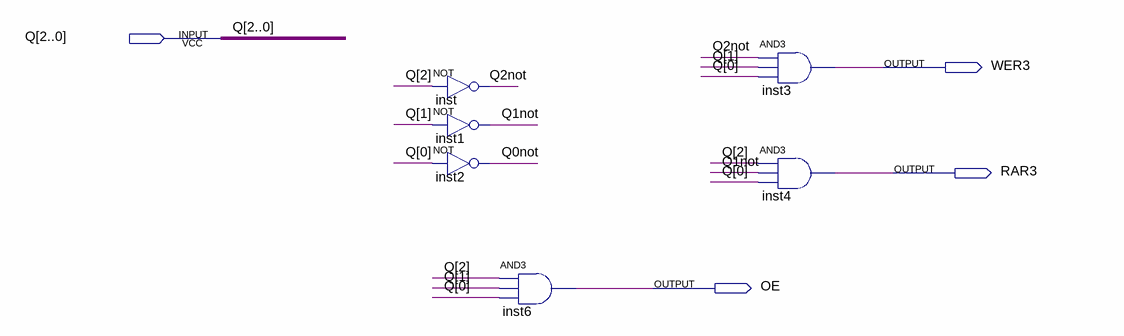
[diagram p0: schematic sheet]
// Quartus schematic R3.bdf as structural Verilog: 6 symbols, 4 pins
module R3 (
  input  [2:0] Q,
  output WER3,
  output RAR3,
  output OE
);

  wire Q0not, Q1not, Q2not;

  not inst (Q2not, Q[2]);
  not inst1 (Q1not, Q[1]);
  not inst2 (Q0not, Q[0]);
  and inst6 (OE, Q[2], Q[1], Q[0]);
  and inst3 (WER3, Q2not, Q[1], Q[0]);
  and inst4 (RAR3, Q[2], Q1not, Q[0]);
endmodule
